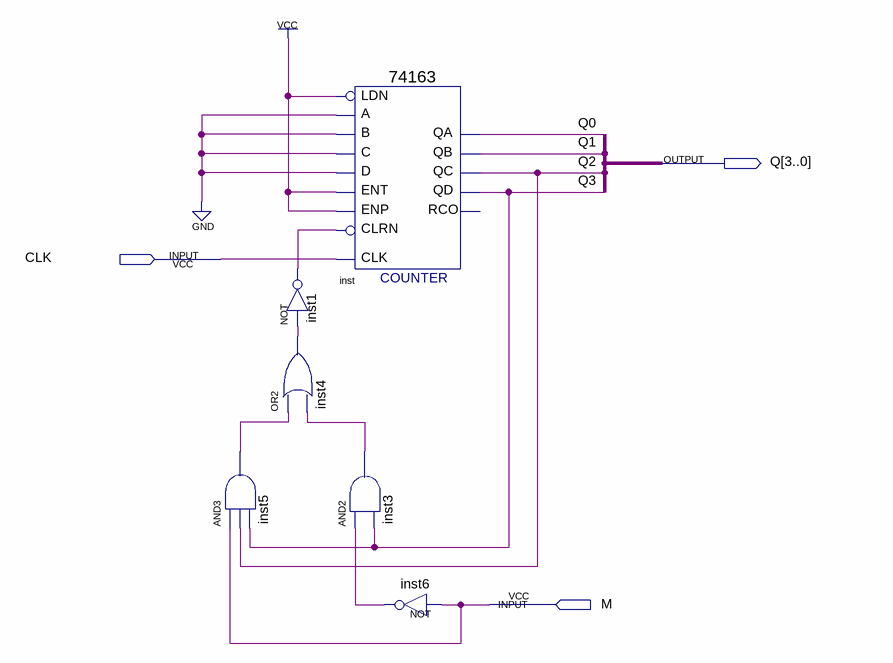
[diagram p0: schematic sheet]
// Quartus schematic MSpecialCount.bdf as structural Verilog: 6 symbols, 3 pins
module MSpecialCount (
  input  CLK,
  input  M,
  output [3:0] Q
);

  wire inst1_out, inst3_out, inst4_out, inst5_out, inst6_out;

  and inst5 (inst5_out, M, Q[2], Q[3]);
  not inst1 (inst1_out, inst4_out);
  or inst4 (inst4_out, inst5_out, inst3_out);
  \74163  inst (
    .C(1'b0), .B(1'b0), .A(1'b0), .ENT(1'b1), .D(1'b0), .CLRN(inst1_out), .CLK(CLK), .ENP(1'b1), .LDN(1'b1),
    .QA(Q[0]), .QB(Q[1]), .QC(Q[2]), .QD(Q[3]));  // open: RCO
  and inst3 (inst3_out, inst6_out, Q[3]);
  not inst6 (inst6_out, M);
endmodule
